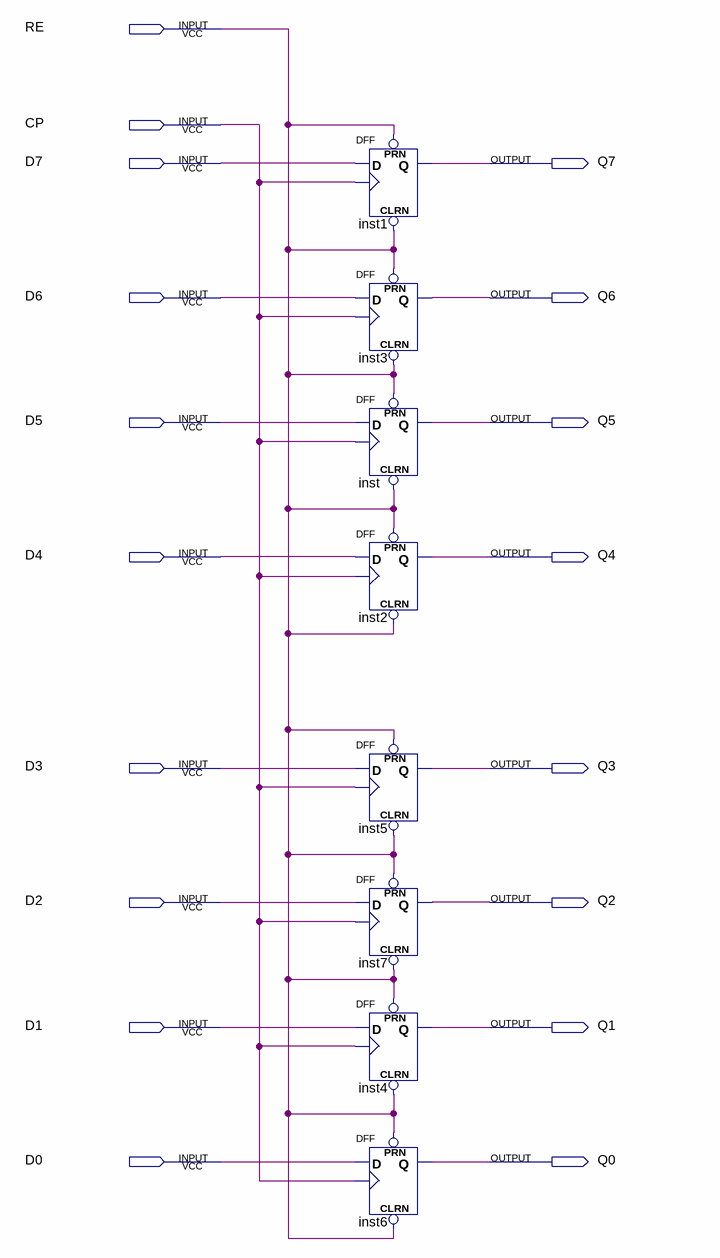
[diagram p0: schematic sheet]
// Quartus schematic IR-8.bdf as structural Verilog: 8 symbols, 18 pins
module \IR-8  (
  input  RE,
  input  CP,
  input  D7,
  input  D6,
  input  D5,
  input  D4,
  input  D3,
  input  D2,
  input  D1,
  input  D0,
  output Q7,
  output Q6,
  output Q5,
  output Q4,
  output Q3,
  output Q2,
  output Q1,
  output Q0
);

  DFF inst1 (.CLRN(RE), .CLK(CP), .D(D7), .PRN(RE), .Q(Q7));
  DFF inst3 (.CLRN(RE), .CLK(CP), .D(D6), .PRN(RE), .Q(Q6));
  DFF inst (.CLRN(RE), .CLK(CP), .D(D5), .PRN(RE), .Q(Q5));
  DFF inst2 (.CLRN(RE), .CLK(CP), .D(D4), .PRN(RE), .Q(Q4));
  DFF inst5 (.CLRN(RE), .CLK(CP), .D(D3), .PRN(RE), .Q(Q3));
  DFF inst7 (.CLRN(RE), .CLK(CP), .D(D2), .PRN(RE), .Q(Q2));
  DFF inst4 (.CLRN(RE), .CLK(CP), .D(D1), .PRN(RE), .Q(Q1));
  DFF inst6 (.CLRN(RE), .CLK(CP), .D(D0), .PRN(RE), .Q(Q0));
endmodule
